# EAGLE schematic bc-module-battery (EAGLE 7.7.0)

## Sheet 1 of 2
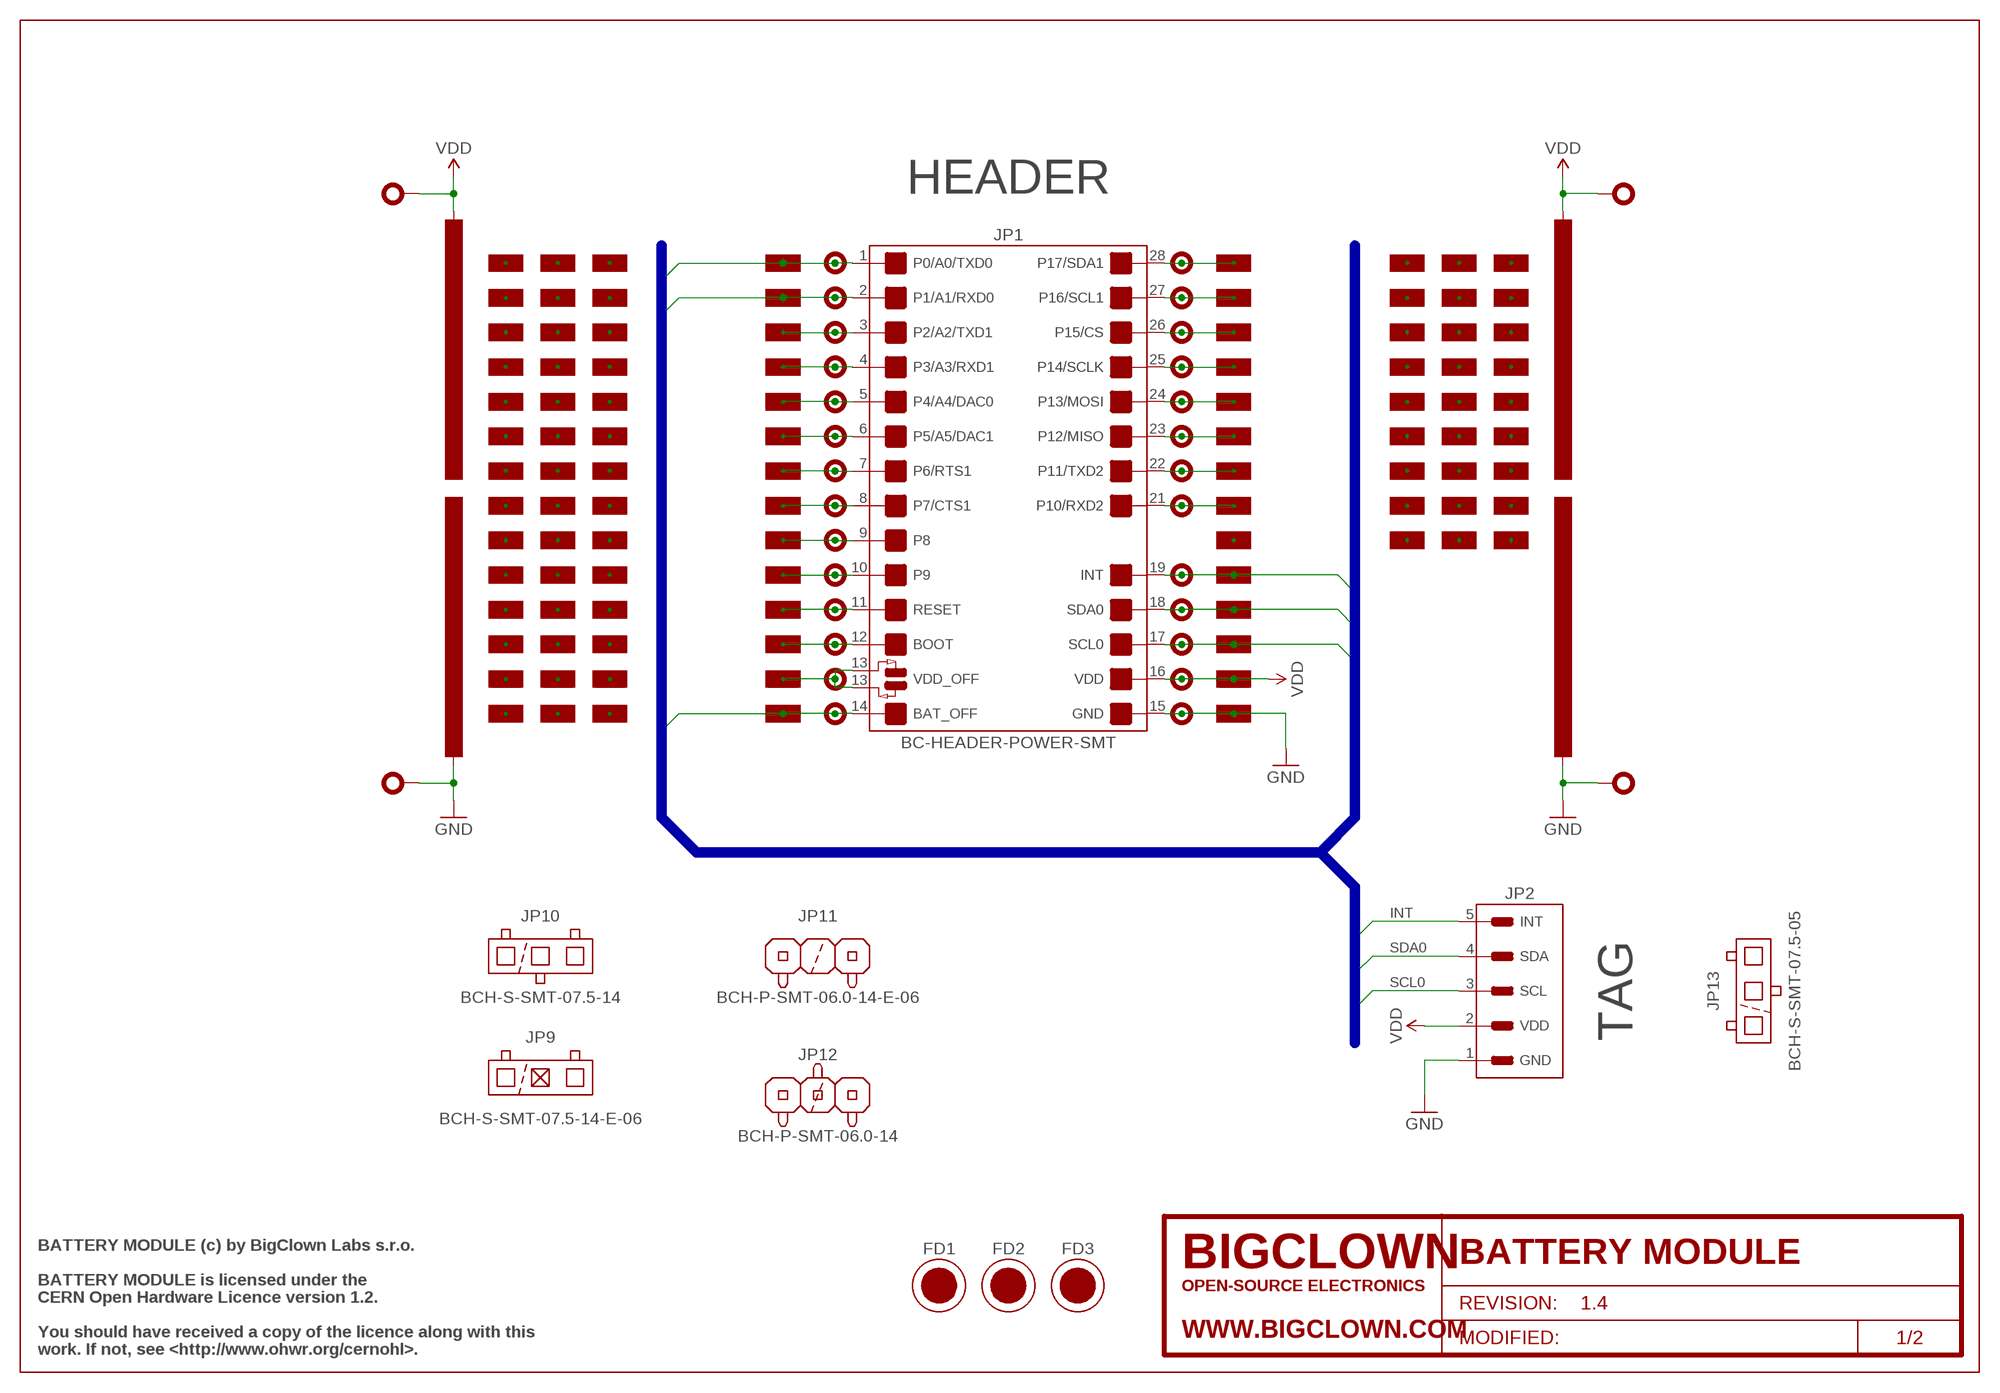
[diagram p0: schematic, sheet 1]

### Parts
FD1  FIDUCIAL  [FIDUCIAL-1MM]
FD2  FIDUCIAL  [FIDUCIAL-1MM]
FD3  FIDUCIAL  [FIDUCIAL-1MM]
FRAME1  FRAME-SCH/A4L-BRD/A4L  [FRAME-A4L]
J1  PAD-THT-0.9MM  [PAD-THT-0.9MM]
J2  PAD-THT-0.9MM  [PAD-THT-0.9MM]
J3  PAD-THT-0.9MM  [PAD-THT-0.9MM]
J4  PAD-THT-0.9MM  [PAD-THT-0.9MM]
J5  PAD-THT-0.9MM  [PAD-THT-0.9MM]
J6  PAD-THT-0.9MM  [PAD-THT-0.9MM]
J7  PAD-THT-0.9MM  [PAD-THT-0.9MM]
J8  PAD-THT-0.9MM  [PAD-THT-0.9MM]
J9  PAD-THT-0.9MM  [PAD-THT-0.9MM]
J10  PAD-THT-0.9MM  [PAD-THT-0.9MM]
J11  PAD-THT-0.9MM  [PAD-THT-0.9MM]
J12  PAD-THT-0.9MM  [PAD-THT-0.9MM]
J13  PAD-THT-0.9MM  [PAD-THT-0.9MM]
J14  PAD-THT-0.9MM  [PAD-THT-0.9MM]
J15  PAD-THT-0.9MM  [PAD-THT-0.9MM]
J16  PAD-THT-0.9MM  [PAD-THT-0.9MM]
J17  PAD-THT-0.9MM  [PAD-THT-0.9MM]
J18  PAD-THT-0.9MM  [PAD-THT-0.9MM]
J19  PAD-THT-0.9MM  [PAD-THT-0.9MM]
J21  PAD-THT-0.9MM  [PAD-THT-0.9MM]
J22  PAD-THT-0.9MM  [PAD-THT-0.9MM]
J23  PAD-THT-0.9MM  [PAD-THT-0.9MM]
J24  PAD-THT-0.9MM  [PAD-THT-0.9MM]
J25  PAD-THT-0.9MM  [PAD-THT-0.9MM]
J26  PAD-THT-0.9MM  [PAD-THT-0.9MM]
J27  PAD-THT-0.9MM  [PAD-THT-0.9MM]
J28  PAD-THT-0.9MM  [PAD-THT-0.9MM]
JB1  PAD-SMD-1.6X19.38  [PAD-SMD-1.6X19.38MM]
JB2  PAD-SMD-1.6X19.38  [PAD-SMD-1.6X19.38MM]
JB3  PAD-SMD-1.6X19.38  [PAD-SMD-1.6X19.38MM]
JB4  PAD-SMD-1.6X19.38  [PAD-SMD-1.6X19.38MM]
JP1  BC-HEADER-POWER-SMT  [BC-HEADER-POWER-SMT]
JP2  BC-HEADER-TAG-SMT  [BC-HEADER-TAG-SMT]
JP3  BC-HEADER-PIN-THT  [BC-HEADER-PIN-THT]
JP4  BC-HEADER-PIN-THT  [BC-HEADER-PIN-THT]
JP5  BC-HEADER-PIN-THT  [BC-HEADER-PIN-THT]
JP6  BC-HEADER-PIN-THT  [BC-HEADER-PIN-THT]
JP9  BCH-S-SMT-07.5-14-E-06  JP-BCH-S-SMT-07.5-14-E-06  [BCH-S-SMT-14-E-06]
JP10  BCH-S-SMT-07.5-14  JP-BCH-S-SMT-07.5-14  [BCH-S-SMT-14]
JP11  BCH-P-SMT-06.0-14-E-06  JP-BCH-P-SMT-06.0-14-E-06  [BCH-P-SMT-14-E-06]
JP12  BCH-P-SMT-06.0-14  JP-BCH-P-SMT-06.0-14  [BCH-P-SMT-14]
JP13  BCH-S-SMT-07.5-05  JP-BCH-S-SMT-07.5-05  [BCH-S-SMT-05]
JS1A  PAD-SMD-1.6X4.14MM  [PAD-SMD-1.6X4.14MM]
JS1B  PAD-SMD-1.6X4.14MM  [PAD-SMD-1.6X4.14MM]
JS1C  PAD-SMD-1.6X4.14MM  [PAD-SMD-1.6X4.14MM]
JS1D  PAD-SMD-1.6X4.14MM  [PAD-SMD-1.6X4.14MM]
JS1E  PAD-SMD-1.6X4.14MM  [PAD-SMD-1.6X4.14MM]
JS1F  PAD-SMD-1.6X4.14MM  [PAD-SMD-1.6X4.14MM]
JS1G  PAD-SMD-1.6X4.14MM  [PAD-SMD-1.6X4.14MM]
JS1H  PAD-SMD-1.6X4.14MM  [PAD-SMD-1.6X4.14MM]
JS2A  PAD-SMD-1.6X4.14MM  [PAD-SMD-1.6X4.14MM]
JS2B  PAD-SMD-1.6X4.14MM  [PAD-SMD-1.6X4.14MM]
JS2C  PAD-SMD-1.6X4.14MM  [PAD-SMD-1.6X4.14MM]
JS2D  PAD-SMD-1.6X4.14MM  [PAD-SMD-1.6X4.14MM]
JS2E  PAD-SMD-1.6X4.14MM  [PAD-SMD-1.6X4.14MM]
JS2F  PAD-SMD-1.6X4.14MM  [PAD-SMD-1.6X4.14MM]
JS2G  PAD-SMD-1.6X4.14MM  [PAD-SMD-1.6X4.14MM]
JS2H  PAD-SMD-1.6X4.14MM  [PAD-SMD-1.6X4.14MM]
JS3A  PAD-SMD-1.6X4.14MM  [PAD-SMD-1.6X4.14MM]
JS3B  PAD-SMD-1.6X4.14MM  [PAD-SMD-1.6X4.14MM]
JS3C  PAD-SMD-1.6X4.14MM  [PAD-SMD-1.6X4.14MM]
JS3D  PAD-SMD-1.6X4.14MM  [PAD-SMD-1.6X4.14MM]
JS3E  PAD-SMD-1.6X4.14MM  [PAD-SMD-1.6X4.14MM]
JS3F  PAD-SMD-1.6X4.14MM  [PAD-SMD-1.6X4.14MM]
JS3G  PAD-SMD-1.6X4.14MM  [PAD-SMD-1.6X4.14MM]
JS3H  PAD-SMD-1.6X4.14MM  [PAD-SMD-1.6X4.14MM]
JS4A  PAD-SMD-1.6X4.14MM  [PAD-SMD-1.6X4.14MM]
JS4B  PAD-SMD-1.6X4.14MM  [PAD-SMD-1.6X4.14MM]
JS4C  PAD-SMD-1.6X4.14MM  [PAD-SMD-1.6X4.14MM]
JS4D  PAD-SMD-1.6X4.14MM  [PAD-SMD-1.6X4.14MM]
JS4E  PAD-SMD-1.6X4.14MM  [PAD-SMD-1.6X4.14MM]
JS4F  PAD-SMD-1.6X4.14MM  [PAD-SMD-1.6X4.14MM]
JS4G  PAD-SMD-1.6X4.14MM  [PAD-SMD-1.6X4.14MM]
JS4H  PAD-SMD-1.6X4.14MM  [PAD-SMD-1.6X4.14MM]
JS5A  PAD-SMD-1.6X4.14MM  [PAD-SMD-1.6X4.14MM]
JS5B  PAD-SMD-1.6X4.14MM  [PAD-SMD-1.6X4.14MM]
JS5C  PAD-SMD-1.6X4.14MM  [PAD-SMD-1.6X4.14MM]
JS5D  PAD-SMD-1.6X4.14MM  [PAD-SMD-1.6X4.14MM]
JS5E  PAD-SMD-1.6X4.14MM  [PAD-SMD-1.6X4.14MM]
JS5F  PAD-SMD-1.6X4.14MM  [PAD-SMD-1.6X4.14MM]
JS5G  PAD-SMD-1.6X4.14MM  [PAD-SMD-1.6X4.14MM]
JS5H  PAD-SMD-1.6X4.14MM  [PAD-SMD-1.6X4.14MM]
JS6A  PAD-SMD-1.6X4.14MM  [PAD-SMD-1.6X4.14MM]
JS6B  PAD-SMD-1.6X4.14MM  [PAD-SMD-1.6X4.14MM]
JS6C  PAD-SMD-1.6X4.14MM  [PAD-SMD-1.6X4.14MM]
JS6D  PAD-SMD-1.6X4.14MM  [PAD-SMD-1.6X4.14MM]
JS6E  PAD-SMD-1.6X4.14MM  [PAD-SMD-1.6X4.14MM]
JS6F  PAD-SMD-1.6X4.14MM  [PAD-SMD-1.6X4.14MM]
JS6G  PAD-SMD-1.6X4.14MM  [PAD-SMD-1.6X4.14MM]
JS6H  PAD-SMD-1.6X4.14MM  [PAD-SMD-1.6X4.14MM]
JS7A  PAD-SMD-1.6X4.14MM  [PAD-SMD-1.6X4.14MM]
JS7B  PAD-SMD-1.6X4.14MM  [PAD-SMD-1.6X4.14MM]
JS7C  PAD-SMD-1.6X4.14MM  [PAD-SMD-1.6X4.14MM]
JS7D  PAD-SMD-1.6X4.14MM  [PAD-SMD-1.6X4.14MM]
JS7E  PAD-SMD-1.6X4.14MM  [PAD-SMD-1.6X4.14MM]
JS7F  PAD-SMD-1.6X4.14MM  [PAD-SMD-1.6X4.14MM]
JS7G  PAD-SMD-1.6X4.14MM  [PAD-SMD-1.6X4.14MM]
JS7H  PAD-SMD-1.6X4.14MM  [PAD-SMD-1.6X4.14MM]
JS8A  PAD-SMD-1.6X4.14MM  [PAD-SMD-1.6X4.14MM]
JS8B  PAD-SMD-1.6X4.14MM  [PAD-SMD-1.6X4.14MM]
JS8C  PAD-SMD-1.6X4.14MM  [PAD-SMD-1.6X4.14MM]
JS8D  PAD-SMD-1.6X4.14MM  [PAD-SMD-1.6X4.14MM]
JS8E  PAD-SMD-1.6X4.14MM  [PAD-SMD-1.6X4.14MM]
JS8F  PAD-SMD-1.6X4.14MM  [PAD-SMD-1.6X4.14MM]
JS8G  PAD-SMD-1.6X4.14MM  [PAD-SMD-1.6X4.14MM]
JS8H  PAD-SMD-1.6X4.14MM  [PAD-SMD-1.6X4.14MM]
JS9A  PAD-SMD-1.6X4.14MM  [PAD-SMD-1.6X4.14MM]
JS9B  PAD-SMD-1.6X4.14MM  [PAD-SMD-1.6X4.14MM]
JS9C  PAD-SMD-1.6X4.14MM  [PAD-SMD-1.6X4.14MM]
JS9D  PAD-SMD-1.6X4.14MM  [PAD-SMD-1.6X4.14MM]
JS9E  PAD-SMD-1.6X4.14MM  [PAD-SMD-1.6X4.14MM]
JS9F  PAD-SMD-1.6X4.14MM  [PAD-SMD-1.6X4.14MM]
JS9G  PAD-SMD-1.6X4.14MM  [PAD-SMD-1.6X4.14MM]
JS9H  PAD-SMD-1.6X4.14MM  [PAD-SMD-1.6X4.14MM]
JS10A  PAD-SMD-1.6X4.14MM  [PAD-SMD-1.6X4.14MM]
JS10B  PAD-SMD-1.6X4.14MM  [PAD-SMD-1.6X4.14MM]
JS10C  PAD-SMD-1.6X4.14MM  [PAD-SMD-1.6X4.14MM]
JS10D  PAD-SMD-1.6X4.14MM  [PAD-SMD-1.6X4.14MM]
JS10E  PAD-SMD-1.6X4.14MM  [PAD-SMD-1.6X4.14MM]
JS11A  PAD-SMD-1.6X4.14MM  [PAD-SMD-1.6X4.14MM]
JS11B  PAD-SMD-1.6X4.14MM  [PAD-SMD-1.6X4.14MM]
JS11C  PAD-SMD-1.6X4.14MM  [PAD-SMD-1.6X4.14MM]
JS11D  PAD-SMD-1.6X4.14MM  [PAD-SMD-1.6X4.14MM]
JS11E  PAD-SMD-1.6X4.14MM  [PAD-SMD-1.6X4.14MM]
JS12A  PAD-SMD-1.6X4.14MM  [PAD-SMD-1.6X4.14MM]
JS12B  PAD-SMD-1.6X4.14MM  [PAD-SMD-1.6X4.14MM]
JS12C  PAD-SMD-1.6X4.14MM  [PAD-SMD-1.6X4.14MM]
JS12D  PAD-SMD-1.6X4.14MM  [PAD-SMD-1.6X4.14MM]
JS12E  PAD-SMD-1.6X4.14MM  [PAD-SMD-1.6X4.14MM]
JS13A  PAD-SMD-1.6X4.14MM  [PAD-SMD-1.6X4.14MM]
JS13B  PAD-SMD-1.6X4.14MM  [PAD-SMD-1.6X4.14MM]
JS13C  PAD-SMD-1.6X4.14MM  [PAD-SMD-1.6X4.14MM]
JS13D  PAD-SMD-1.6X4.14MM  [PAD-SMD-1.6X4.14MM]
JS13E  PAD-SMD-1.6X4.14MM  [PAD-SMD-1.6X4.14MM]
JS14A  PAD-SMD-1.6X4.14MM  [PAD-SMD-1.6X4.14MM]
JS14B  PAD-SMD-1.6X4.14MM  [PAD-SMD-1.6X4.14MM]
JS14C  PAD-SMD-1.6X4.14MM  [PAD-SMD-1.6X4.14MM]
JS14D  PAD-SMD-1.6X4.14MM  [PAD-SMD-1.6X4.14MM]
JS14E  PAD-SMD-1.6X4.14MM  [PAD-SMD-1.6X4.14MM]

### Nets
BAT_OFF: J14.0 JP1.14(BAT_OFF) JS14D.0 ; also sheet 2
BOOT: J12.0 JP1.12(BOOT) JS12D.0
GND: J15.0 JB2.0 JB4.0 JP1.15(GND) JP2.1(GND) JP4.0 JP6.0 JS14E.0 ; also sheet 2
INT: J19.0 JP1.19(INT) JP2.5(INT) JS10E.0 ; also sheet 2
P0/A0/TXD0: J1.0 JP1.1(P0/A0/TXD0) JS1D.0 ; also sheet 2
P1/A1/RXD0: J2.0 JP1.2(P1/A1/RXD0) JS2D.0 ; also sheet 2
P2/A2/TXD1: J3.0 JP1.3(P2/A2/TXD1) JS3D.0
P3/A3/RXD1: J4.0 JP1.4(P3/A3/RXD1) JS4D.0
P4/A4/DAC0: J5.0 JP1.5(P4/A4/DAC0) JS5D.0
P5/A5/DAC1: J6.0 JP1.6(P5/A5/DAC1) JS6D.0
P6/RTS1: J7.0 JP1.7(P6/RTS1) JS7D.0
P7/CTS1: J8.0 JP1.8(P7/CTS1) JS8D.0
P8: J9.0 JP1.9(P8) JS9D.0
P9: J10.0 JP1.10(P9) JS10D.0
P10/RXD2: J21.0 JP1.21(P10/RXD2) JS8E.0
P11/TXD2: J22.0 JP1.22(P11/TXD2) JS7E.0
P12/MISO: J23.0 JP1.23(P12/MISO) JS6E.0
P13/MOSI: J24.0 JP1.24(P13/MOSI) JS5E.0
P14/SCLK: J25.0 JP1.25(P14/SCLK) JS4E.0
P15/CS: J26.0 JP1.26(P15/CS) JS3E.0
P16/SCL1: J27.0 JP1.27(P16/SCL1) JS2E.0
P17/SDA1: J28.0 JP1.28(P17/SDA1) JS1E.0
RESET: J11.0 JP1.11(RESET) JS11D.0
SCL0: J17.0 JP1.17(SCL0) JP2.3(SCL) JS12E.0
SDA0: J18.0 JP1.18(SDA0) JP2.4(SDA) JS11E.0
VDD: J16.0 JB1.0 JB3.0 JP1.16(VDD) JP2.2(VDD) JP3.0 JP5.0 JS13E.0 ; also sheet 2
VDD_OFF: J13.0 JP1.13B(VDD_OFF_OUT) JP1.13T(VDD_OFF_IN) JS13D.0
Unconnected: JS1A.0 JS1B.0 JS1C.0 JS1F.0 JS1G.0 JS1H.0 JS2A.0 JS2B.0 JS2C.0 JS2F.0 JS2G.0 JS2H.0 JS3A.0 JS3B.0 JS3C.0 JS3F.0 JS3G.0 JS3H.0 JS4A.0 JS4B.0 JS4C.0 JS4F.0 JS4G.0 JS4H.0 JS5A.0 JS5B.0 JS5C.0 JS5F.0 JS5G.0 JS5H.0 JS6A.0 JS6B.0 JS6C.0 JS6F.0 JS6G.0 JS6H.0 JS7A.0 JS7B.0 JS7C.0 JS7F.0 JS7G.0 JS7H.0 JS8A.0 JS8B.0 JS8C.0 JS8F.0 JS8G.0 JS8H.0 JS9A.0 JS9B.0 JS9C.0 JS9E.0 JS9F.0 JS9G.0 JS9H.0 JS10A.0 JS10B.0 JS10C.0 JS11A.0 JS11B.0 JS11C.0 JS12A.0 JS12B.0 JS12C.0 JS13A.0 JS13B.0 JS13C.0 JS14A.0 JS14B.0 JS14C.0

### Buses
BAT_OFF,INT,SDA0,SCL0,P0/A0/TXD0,P1/A1/RXD0

### Notes on the sheet
- HEADER
- TAG
- BATTERY MODULE (c) by BigClown Labs s.r.o.
- BATTERY MODULE is licensed under the
- CERN Open Hardware Licence version 1.2.
- You should have received a copy of the licence along with this
- work. If not, see <http://www.ohwr.org/cernohl>.

## Sheet 2 of 2
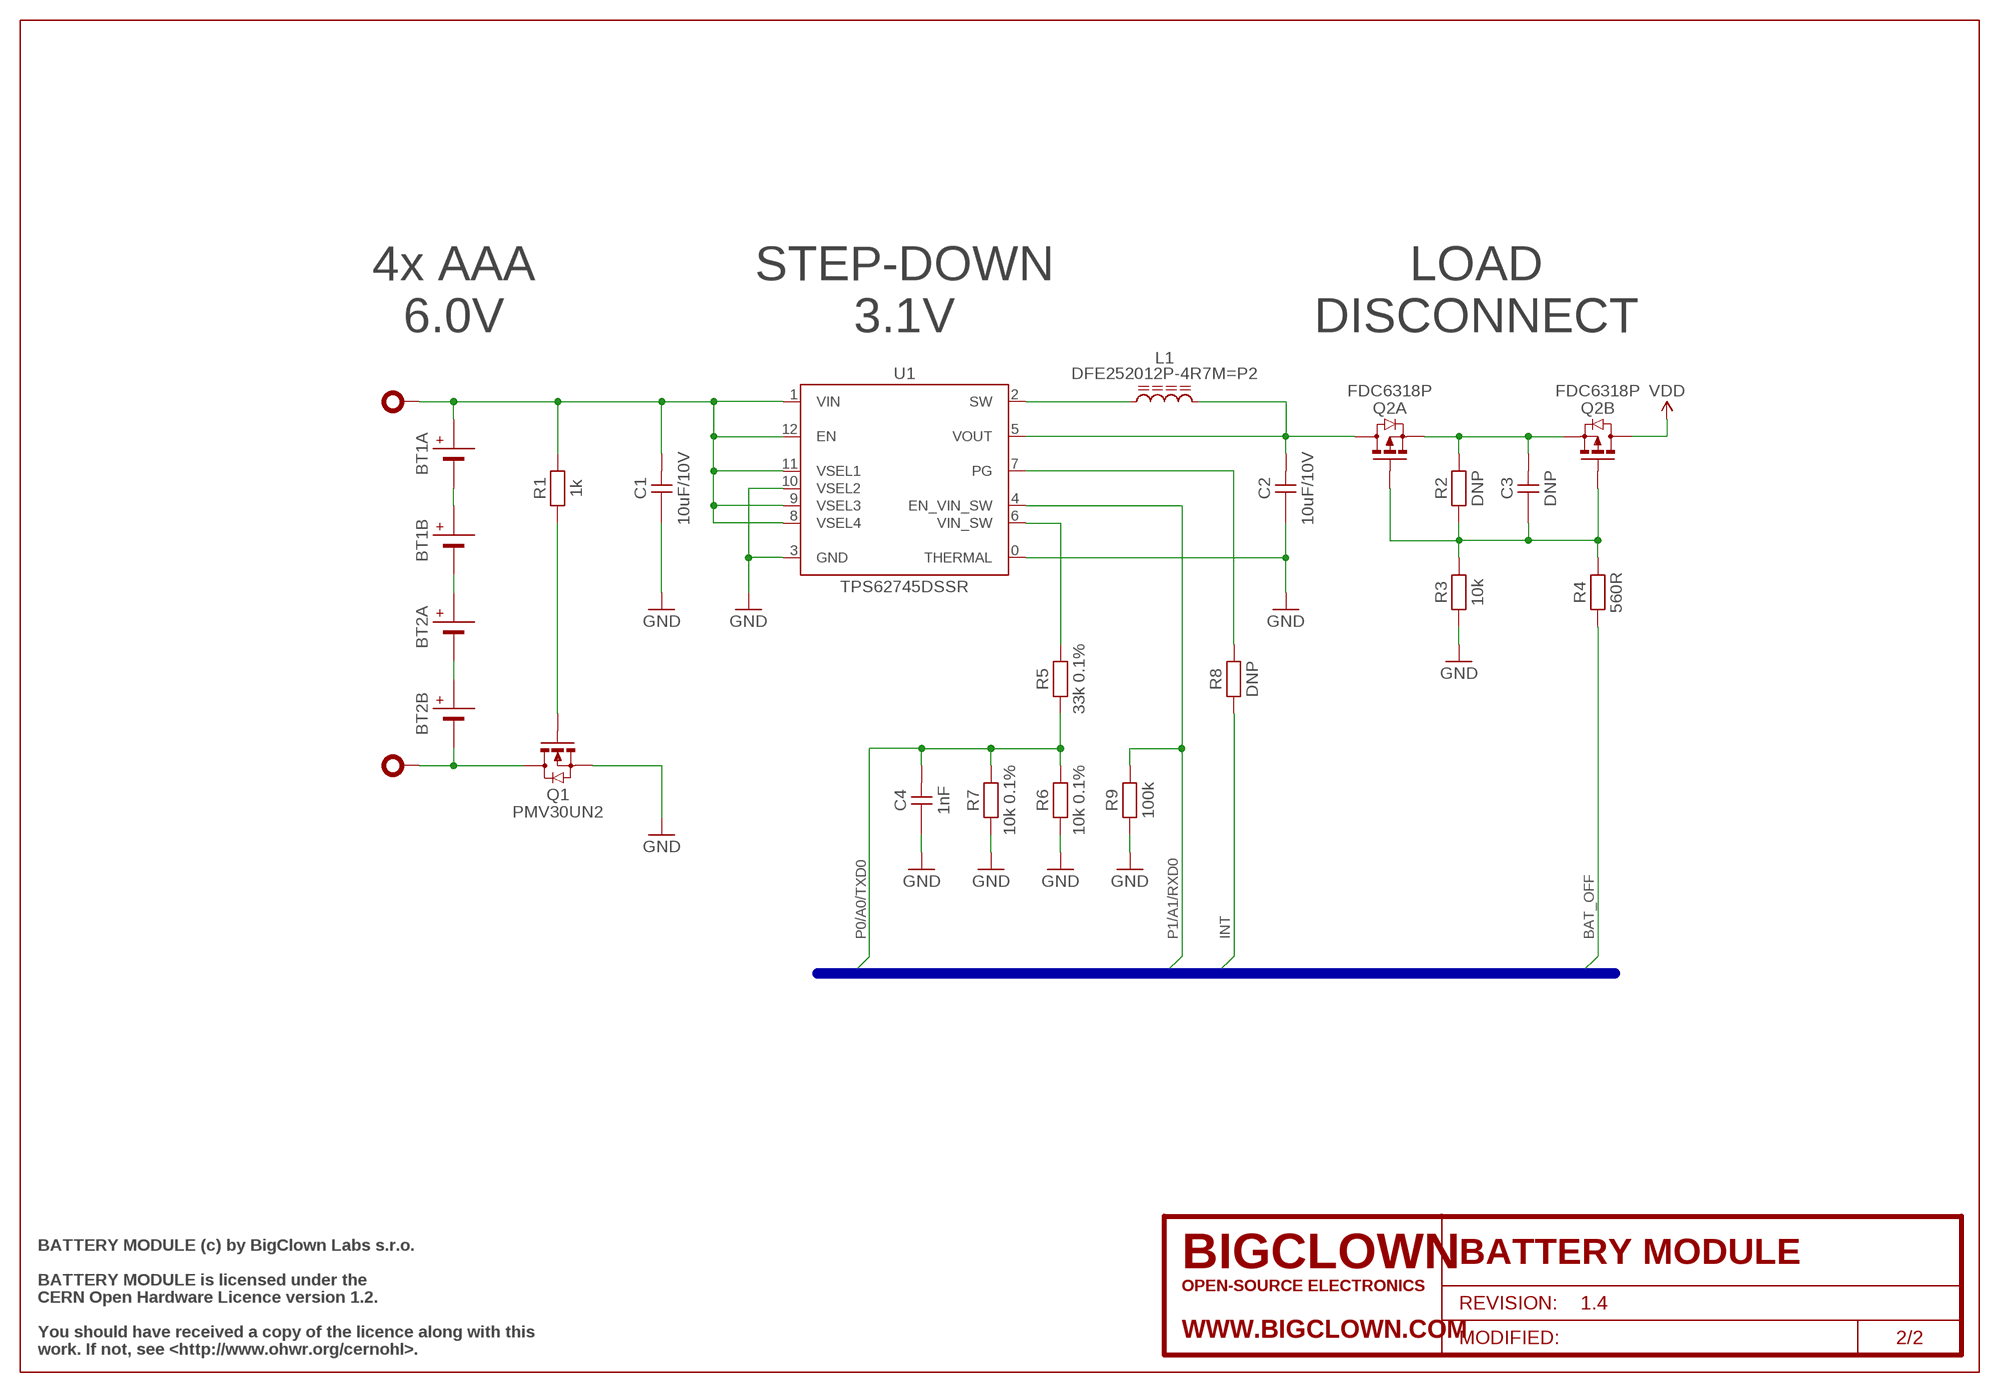
[diagram p1: schematic, sheet 2]
FRAME2 (FRAME-SCH/A4L-BRD/NONE): BCPN: -; PROJECT_NAME: BATTERY MODULE; PROJECT_REVISION: 1.4

### Parts
BT1  BOSCOM-1023  BT-BOSCOM-1023  [BOSCOM-1023_T]
BT2  BOSCOM-1023  BT-BOSCOM-1023  [BOSCOM-1023_T]
C1  10uF/10V  C-0805-10UF-10V  [CAPACITOR-0805_R]
C2  10uF/10V  C-0805-10UF-10V  [CAPACITOR-0805_R]
C3  DNP  C-0805-DNP  [CAPACITOR-0805_R]
C4  1nF  C-0805-1NF  [CAPACITOR-0805_R]
JP7  BC-HEADER-PIN-THT  [BC-HEADER-PIN-THT]
JP8  BC-HEADER-PIN-THT  [BC-HEADER-PIN-THT]
L1  DFE252012P-4R7M=P2  L-DFE252012P-4R7M=P2  [DFE252012P-4R7M=P2_R]
Q1  PMV30UN2  Q-PMV30UN2  [SOT-23_R]
Q2  FDC6318P  Q-FDC6318P  [SSOT-6L_R]
R1  1k  R-0805-1K  [RESISTOR-0805_R]
R2  DNP  R-0805-DNP  [RESISTOR-0805_R]
R3  10k  R-0805-10K  [RESISTOR-0805_R]
R4  560R  R-0805-560R  [RESISTOR-0805_R]
R5  33k 0.1%  R-0805-33K-0.1%  [RESISTOR-0805_R]
R6  10k 0.1%  R-0805-10K-0.1%  [RESISTOR-0805_R]
R7  10k 0.1%  R-0805-10K-0.1%  [RESISTOR-0805_R]
R8  DNP  R-0805-DNP  [RESISTOR-0805_R]
R9  100k  R-0805-100K  [RESISTOR-0805_R]
U1  TPS62745DSSR  U-TPS62745DSSR  [TPS62745DSSR_R]

### Nets
+3.1V: C2.1 L1.2 Q2.6(A:D) U1.5(VOUT)
+VBAT: BT1.P1(A:P) C1.1 JP7.0 R1.2 U1.1(VIN) U1.8(VSEL4) U1.9(VSEL3) U1.11(VSEL1) U1.12(EN)
-VBAT: BT2.M2(B:M) JP8.0 Q1.3(D)
BAT_OFF: R4.1 ; also sheet 1
BT1A_BT1B: BT1.M1(A:M) BT1.P2(B:P)
BT1B_BT2A: BT1.M2(B:M) BT2.P1(A:P)
BT2A_BT2B: BT2.M1(A:M) BT2.P2(B:P)
DISCONNECT_GATE: C3.2 Q2.1(A:G) Q2.3(B:G) R2.1 R3.2 R4.2
DISCONNECT_SOURCE: C3.1 Q2.2(B:S) Q2.5(A:S) R2.2
GND: C1.2 C2.2 C4.2 Q1.2(S) R3.1 R6.1 R7.1 R9.1 U1.0(THERMAL) U1.3(GND) U1.10(VSEL2) ; also sheet 1
INT: R8.1 ; also sheet 1
P0/A0/TXD0: C4.1 R5.1 R6.2 R7.2 ; also sheet 1
P1/A1/RXD0: R9.2 U1.4(EN_VIN_SW) ; also sheet 1
PG: R8.2 U1.7(PG)
REVERSE_G: Q1.1(G) R1.1
SW: L1.1 U1.2(SW)
VDD: Q2.4(B:D) ; also sheet 1
VIN_SW: R5.2 U1.6(VIN_SW)

### Buses
BAT_OFF,INT,SDA0,SCL0,P0/A0/TXD0,P1/A1/RXD0

### Notes on the sheet
- 4x AAA | STEP-DOWN | LOAD
- 6.0V | 3.1V | DISCONNECT
- BATTERY MODULE (c) by BigClown Labs s.r.o.
- BATTERY MODULE is licensed under the
- CERN Open Hardware Licence version 1.2.
- You should have received a copy of the licence along with this
- work. If not, see <http://www.ohwr.org/cernohl>.

## Library data of the parts
BT1 BT2 = bc-battery:BT-BOSCOM-1023; BCPN: BC-BT-BOSCOM-1023
C1 C2 = bc-capacitor:C-0805-10UF-10V; BCPN: BC-C-0805-10UF-10V
C3 = bc-capacitor:C-0805-DNP; BCPN: -
C4 = bc-capacitor:C-0805-1NF; BCPN: BC-C-0805-1NF
FD1-FD3 = bc-fiducial:FIDUCIAL; BCPN: -
FRAME1 = bc-frame:FRAME-SCH/A4L-BRD/A4L; BCPN: -; PROJECT_NAME: BATTERY MODULE; PROJECT_REVISION: 1.4
J1-J19 J21-J28 = bc-prototype:PAD-THT-0.9MM; BCPN: -
JB1-JB4 = bc-prototype:PAD-SMD-1.6X19.38; BCPN: -
JP1 = bc-header:BC-HEADER-POWER-SMT; BCPN: -
JP2 = bc-header:BC-HEADER-TAG-SMT; BCPN: -
JP3-JP8 = bc-header:BC-HEADER-PIN-THT; BCPN: -
JP9 = bc-header:JP-BCH-S-SMT-07.5-14-E-06; BCPN: BC-JP-BCH-S-SMT-07.5-14-E-06
JP10 = bc-header:JP-BCH-S-SMT-07.5-14; BCPN: BC-JP-BCH-S-SMT-07.5-14
JP11 = bc-header:JP-BCH-P-SMT-06.0-14-E-06; BCPN: BC-JP-BCH-P-SMT-06.0-14-E-06
JP12 = bc-header:JP-BCH-P-SMT-06.0-14; BCPN: BC-JP-BCH-P-SMT-06.0-14
JP13 = bc-header:JP-BCH-S-SMT-07.5-05; BCPN: BC-JP-BCH-S-SMT-07.5-05
JS1A JS1B JS1C JS1D JS1E JS1F JS1G JS1H JS2A JS2B JS2C JS2D JS2E JS2F JS2G JS2H JS3A JS3B JS3C JS3D JS3E JS3F JS3G JS3H JS4A JS4B JS4C JS4D JS4E JS4F JS4G JS4H JS5A JS5B JS5C JS5D JS5E JS5F JS5G JS5H JS6A JS6B JS6C JS6D JS6E JS6F JS6G JS6H JS7A JS7B JS7C JS7D JS7E JS7F JS7G JS7H JS8A JS8B JS8C JS8D JS8E JS8F JS8G JS8H JS9A JS9B JS9C JS9D JS9E JS9F JS9G JS9H JS10A JS10B JS10C JS10D JS10E JS11A JS11B JS11C JS11D JS11E JS12A JS12B JS12C JS12D JS12E JS13A JS13B JS13C JS13D JS13E JS14A JS14B JS14C JS14D JS14E = bc-prototype:PAD-SMD-1.6X4.14MM; BCPN: -
L1 = bc-inductor:L-DFE252012P-4R7M=P2; BCPN: BC-L-DFE252012P-4R7M=P2
Q1 = bc-discrete:Q-PMV30UN2; BCPN: BC-Q-PMV30UN2
Q2 = bc-discrete:Q-FDC6318P; BCPN: BC-Q-FDC6318P
R1 = bc-resistor:R-0805-1K; BCPN: BC-R-0805-1K
R2 R8 = bc-resistor:R-0805-DNP; BCPN: -
R3 = bc-resistor:R-0805-10K; BCPN: BC-R-0805-10K
R4 = bc-resistor:R-0805-560R; BCPN: BC-R-0805-560R
R5 = bc-resistor:R-0805-33K-0.1%; BCPN: BC-R-0805-33K-0.1%
R6 R7 = bc-resistor:R-0805-10K-0.1%; BCPN: BC-R-0805-10K-0.1%
R9 = bc-resistor:R-0805-100K; BCPN: BC-R-0805-100K
U1 = bc-power:U-TPS62745DSSR; BCPN: BC-U-TPS62745DSSR